# EAGLE design virajgandhi_servo_attiny44_with5v_regulator (EAGLE 8.0.2)
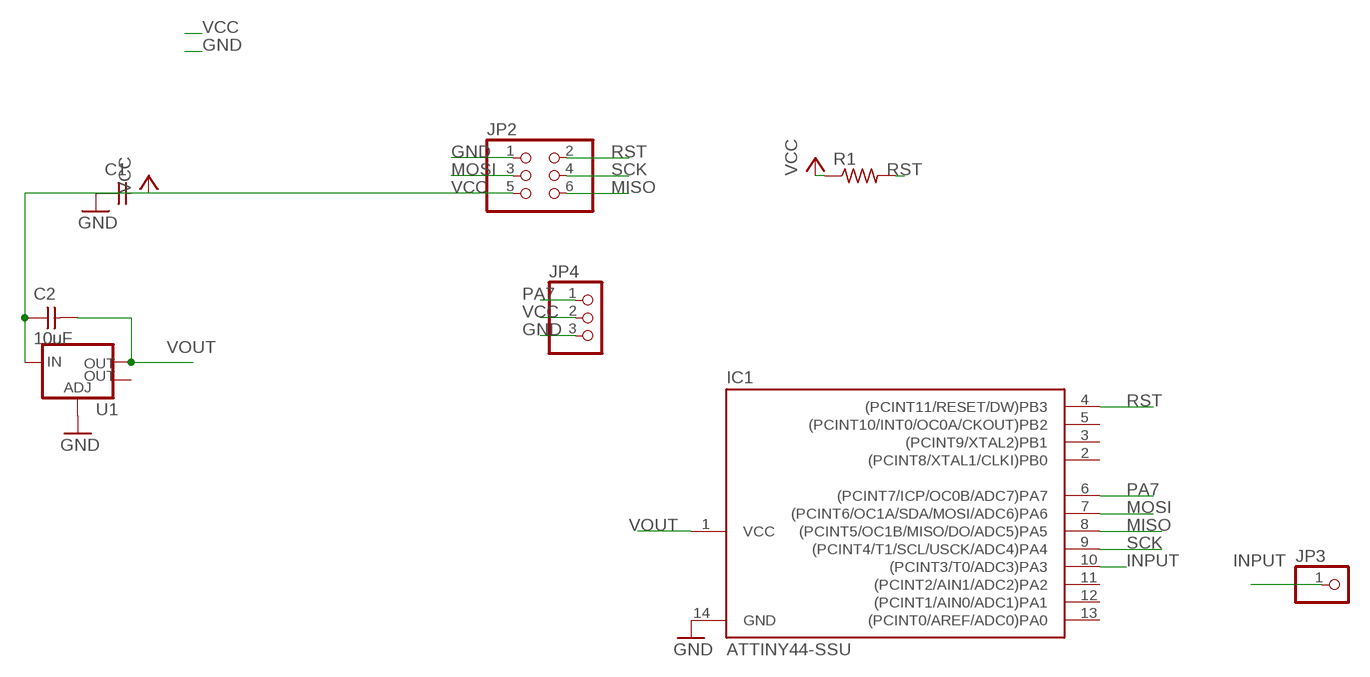
[diagram p0: schematic, sheet 1]

## Parts
C1  CAP-UNPOLARIZEDFAB  [C1206FAB]
C2  10uF  CAP-UNPOLARIZEDFAB  [C1206FAB]
IC1  ATTINY44-SSU  [SOIC14]
JP2  PINHD-2X3-SMD  [2X03SMD]
JP3  PINHD-1X1  [1X01]
JP4  PINHD-1X3  [1X03]
R1  RES-US1206FAB  [R1206FAB]
U1  V_REG_LM1117SOT223  [SOT223]

## Nets
GND: C1.1 IC1.14(GND) JP2.1 JP4.3 U1.1(ADJ)
INPUT: IC1.10((PCINT3/T0/ADC3)PA3) JP3.1
MISO: IC1.8((PCINT5/OC1B/MISO/DO/ADC5)PA5) JP2.6
MOSI: IC1.7((PCINT6/OC1A/SDA/MOSI/ADC6)PA6) JP2.3
PA7: IC1.6((PCINT7/ICP/OC0B/ADC7)PA7) JP4.1
RST: IC1.4((PCINT11/RESET/DW)PB3) JP2.2 R1.2
SCK: IC1.9((PCINT4/T1/SCL/USCK/ADC4)PA4) JP2.4
VCC: C1.2 C2.1 JP2.5 JP4.2 R1.1 U1.3(IN)
VOUT: C2.2 IC1.1(VCC) U1.2(OUT)
Unconnected: IC1.2((PCINT8/XTAL1/CLKI)PB0) IC1.3((PCINT9/XTAL2)PB1) IC1.5((PCINT10/INT0/OC0A/CKOUT)PB2) IC1.11((PCINT2/AIN1/ADC2)PA2) IC1.12((PCINT1/AIN0/ADC1)PA1) IC1.13((PCINT0/AREF/ADC0)PA0) U1.4(OUT)

## Library data of the parts
C1 C2 = fab:CAP-UNPOLARIZED
IC1 = fab:ATTINY44
JP2 = fab:PINHD-2X3-SMD: PIN HEADER
JP3 = 01_adafruit:PINHD-1X1: Pin header 1x1 for 0.1" spacing With round pins
JP4 = 01_adafruit:PINHD-1X3: PIN HEADER
R1 = fab:RES-US: Resistor (US Symbol) Variants with postfix FAB are widened to allow the routing of internal traces
U1 = fab:V_REG_LM1117: Voltage Regulator LM1117 Standard adjustable voltage regulator but in SMD form. Spark Fun Electronics SKU : COM-00595; PROD_ID: VREG-08170

## Net classes
0 default: width 0.1 mm, clearance 0.4 mm

## Board
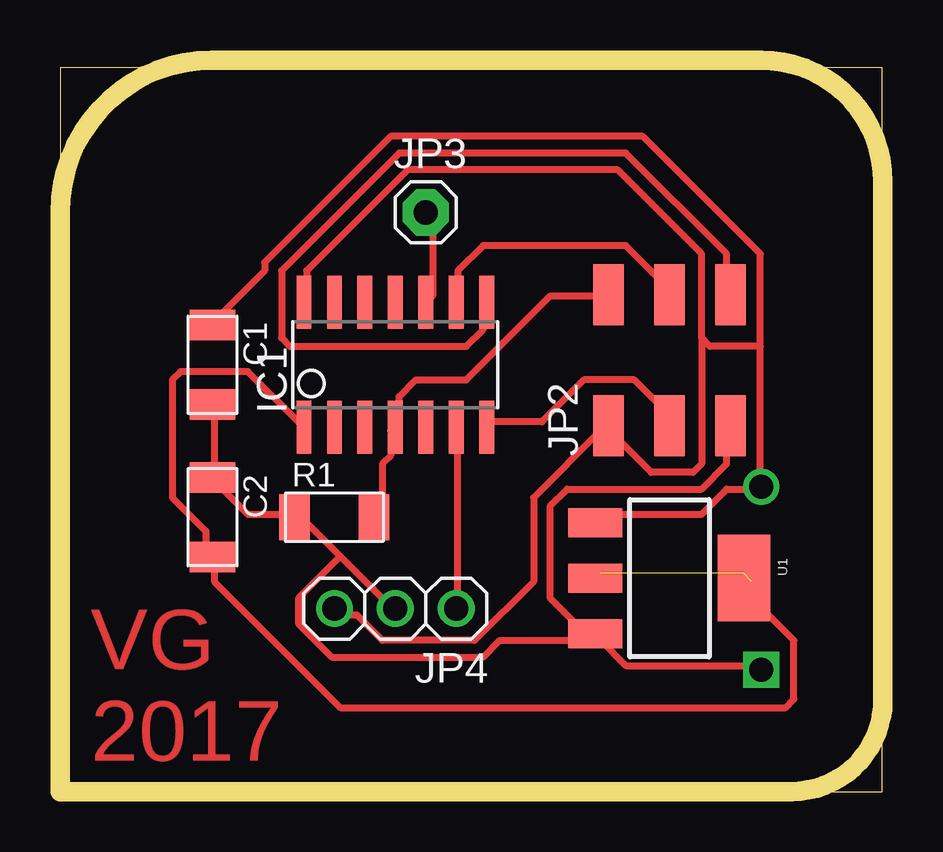
[diagram p1: board, top side]

Size 34.29 x 30.48 mm. Coordinates in mm from the lower left corner, seen from the top.
Outline: 30.48,0 34.27,0 34.27,30.15 0,30.15 0,0
Outline: 0,0 30.48,0
Outline: 30.48,0 arc90 34.29,3.81 34.29,25.4 arc90 29.21,30.48 6.35,30.48 arc90 0,24.13 0,0
Copper layers (1*16): Top 0.035mm / dielectric 1.5mm / Bottom 0.035mm
Design rules "fab": minimum track width 0.3mm, minimum drill 32mil, track to track 0.315mm, track to pad 0.315mm, pad to pad 0.315mm, via to via 0.315mm, smd to smd 0.315mm, copper to edge 40mil, drill to drill 16mil, minimum pad ring 10mil, minimum via ring 8mil, stop-mask expansion 4mil, vias tented up to drill 0mil, thermal gap 10mil

### Footprints (pad centres in the part's own frame; a part is rotated, then mirrored left to right if it is on the bottom)
C1206FAB = smd 1.27 x 1.905: 1 -1.651,0; 2 1.651,0
SOIC14 = smd 0.61 x 2.21: 1 -3.81,-2.603; 2 -2.54,-2.603; 3 -1.27,-2.603; 4 0,-2.603; 5 1.27,-2.603; 6 2.54,-2.603; 7 3.81,-2.603; 8 3.81,2.603; 9 2.54,2.603; 10 1.27,2.603; 11 0,2.603; 12 -1.27,2.603; 13 -2.54,2.603; 14 -3.81,2.603
2X03SMD = smd 2.54 x 1.27: 1 -2.54,2.54; 2 2.92,2.54; 3 -2.54,0; 4 2.92,0; 5 -2.54,-2.54; 6 2.92,-2.54
1X01 = drill 1.016 pad 1.93 octagon: 1 0,0
1X03 = drill 1.016: 1 -2.54,0; 2 0,0; 3 2.54,0
R1206FAB = smd 1.27 x 1.905: 1 -1.651,0; 2 1.651,0
SOT223 = smd 1.219 x 2.235: 1 -2.311,-3.099; 2 0,-3.099; 3 2.311,-3.099 | smd 3.6 x 2.2: 4 0,3.099

### Placement (x,y rotation side)
C1  6.35,17.78 270 top
C2  6.35,11.43 270 top
IC1  13.97,17.78 0 top
JP2  25.4,17.78 90 top
JP3  15.24,24.13 0 top
JP4  13.97,7.62 180 top
R1  11.43,11.43 0 top
U1  25.4,8.89 270 top

### Tracks (layer width: path | path; a pad name or v marks a point on that pad's centre or on a via)
GND  (via drill 1)
  Top 0.3: U1.1 22.53,11.55 26.73,11.55 27.78,12.6 29.18,12.6 v29.21,12.7 29.18,12.95 29.18,18.55 | 29.18,18.55 29.18,22.4 24.28,27.3 13.78,27.3 8.53,22.05 8.53,21.7 6.43,19.6 C1.1 | 26.73,18.9 26.73,22.4 23.23,25.9 14.48,25.9 10.28,21.7 10.28,20.65 IC1.14 | 26.73,18.9 27.08,18.55 29.18,18.55 | 26.73,18.9 26.73,13.65 26.38,13.3 24.63,13.3 22.88,15.05 JP2.1 22.53,15.05 19.73,12.25 19.73,8.75 17.28,6.3 13.43,6.3 12.38,7.35 11.68,7.35 JP4.3
INPUT
  Top 0.3: IC1.10 15.53,20.65 15.53,23.8 JP3.1
MISO
  Top 0.3: IC1.8 17.63,20.3 17.63,19.25 16.93,18.55 9.58,18.55 9.23,18.9 9.23,21.7 14.13,26.6 23.58,26.6 27.78,22.4 27.78,21 JP2.6
MOSI
  Top 0.3: IC1.7 17.98,15.4 20.08,15.4 21.83,17.15 23.93,17.15 25.68,15.4 JP2.3
PA7
  Top 0.3: IC1.6 16.58,15.05 16.58,7.7 JP4.1
RST
  Top 0.3: R1.2 13.43,11.55 13.43,13.65 13.78,14 13.78,15.05 IC1.4 14.13,15.4 14.13,16.45 14.83,17.15 16.93,17.15 20.43,20.65 22.53,20.65 JP2.2
SCK
  Top 0.3: IC1.9 16.58,20.65 16.58,21.7 17.63,22.75 23.58,22.75 25.33,21 JP2.4
VCC  (via drill 1)
  Top 0.3: v29.21,5.08 29.18,5.25 23.58,5.25 22.53,6.3 U1.3 22.18,6.3 | 22.18,6.3 20.43,8.05 20.43,11.9 21.13,12.6 26.73,12.6 27.78,13.65 27.78,15.05 JP2.5 | C1.2 6.43,16.1 6.43,13.3 C2.1 6.43,12.95 7.83,11.55 9.58,11.55 R1.1 9.93,11.55 11.68,9.8 | 11.68,9.8 13.78,7.7 JP4.2 | 22.18,6.3 18.33,6.3 17.63,5.6 11.33,5.6 9.93,7 9.93,8.05 11.68,9.8
VOUT  (2 unrouted)
  Top 0.3: 22.53,9.1 U1.2 | IC1.1 9.93,15.4 7.83,17.5 5.03,17.5 4.68,17.15 4.68,12.25 6.08,10.85 6.08,9.8 C2.2 6.43,9.45 6.43,8.75 11.68,3.5 30.23,3.5 30.58,3.85 30.58,6.3 28.83,8.05 28.83,8.75

### Text on the board
Top: VG / 2017